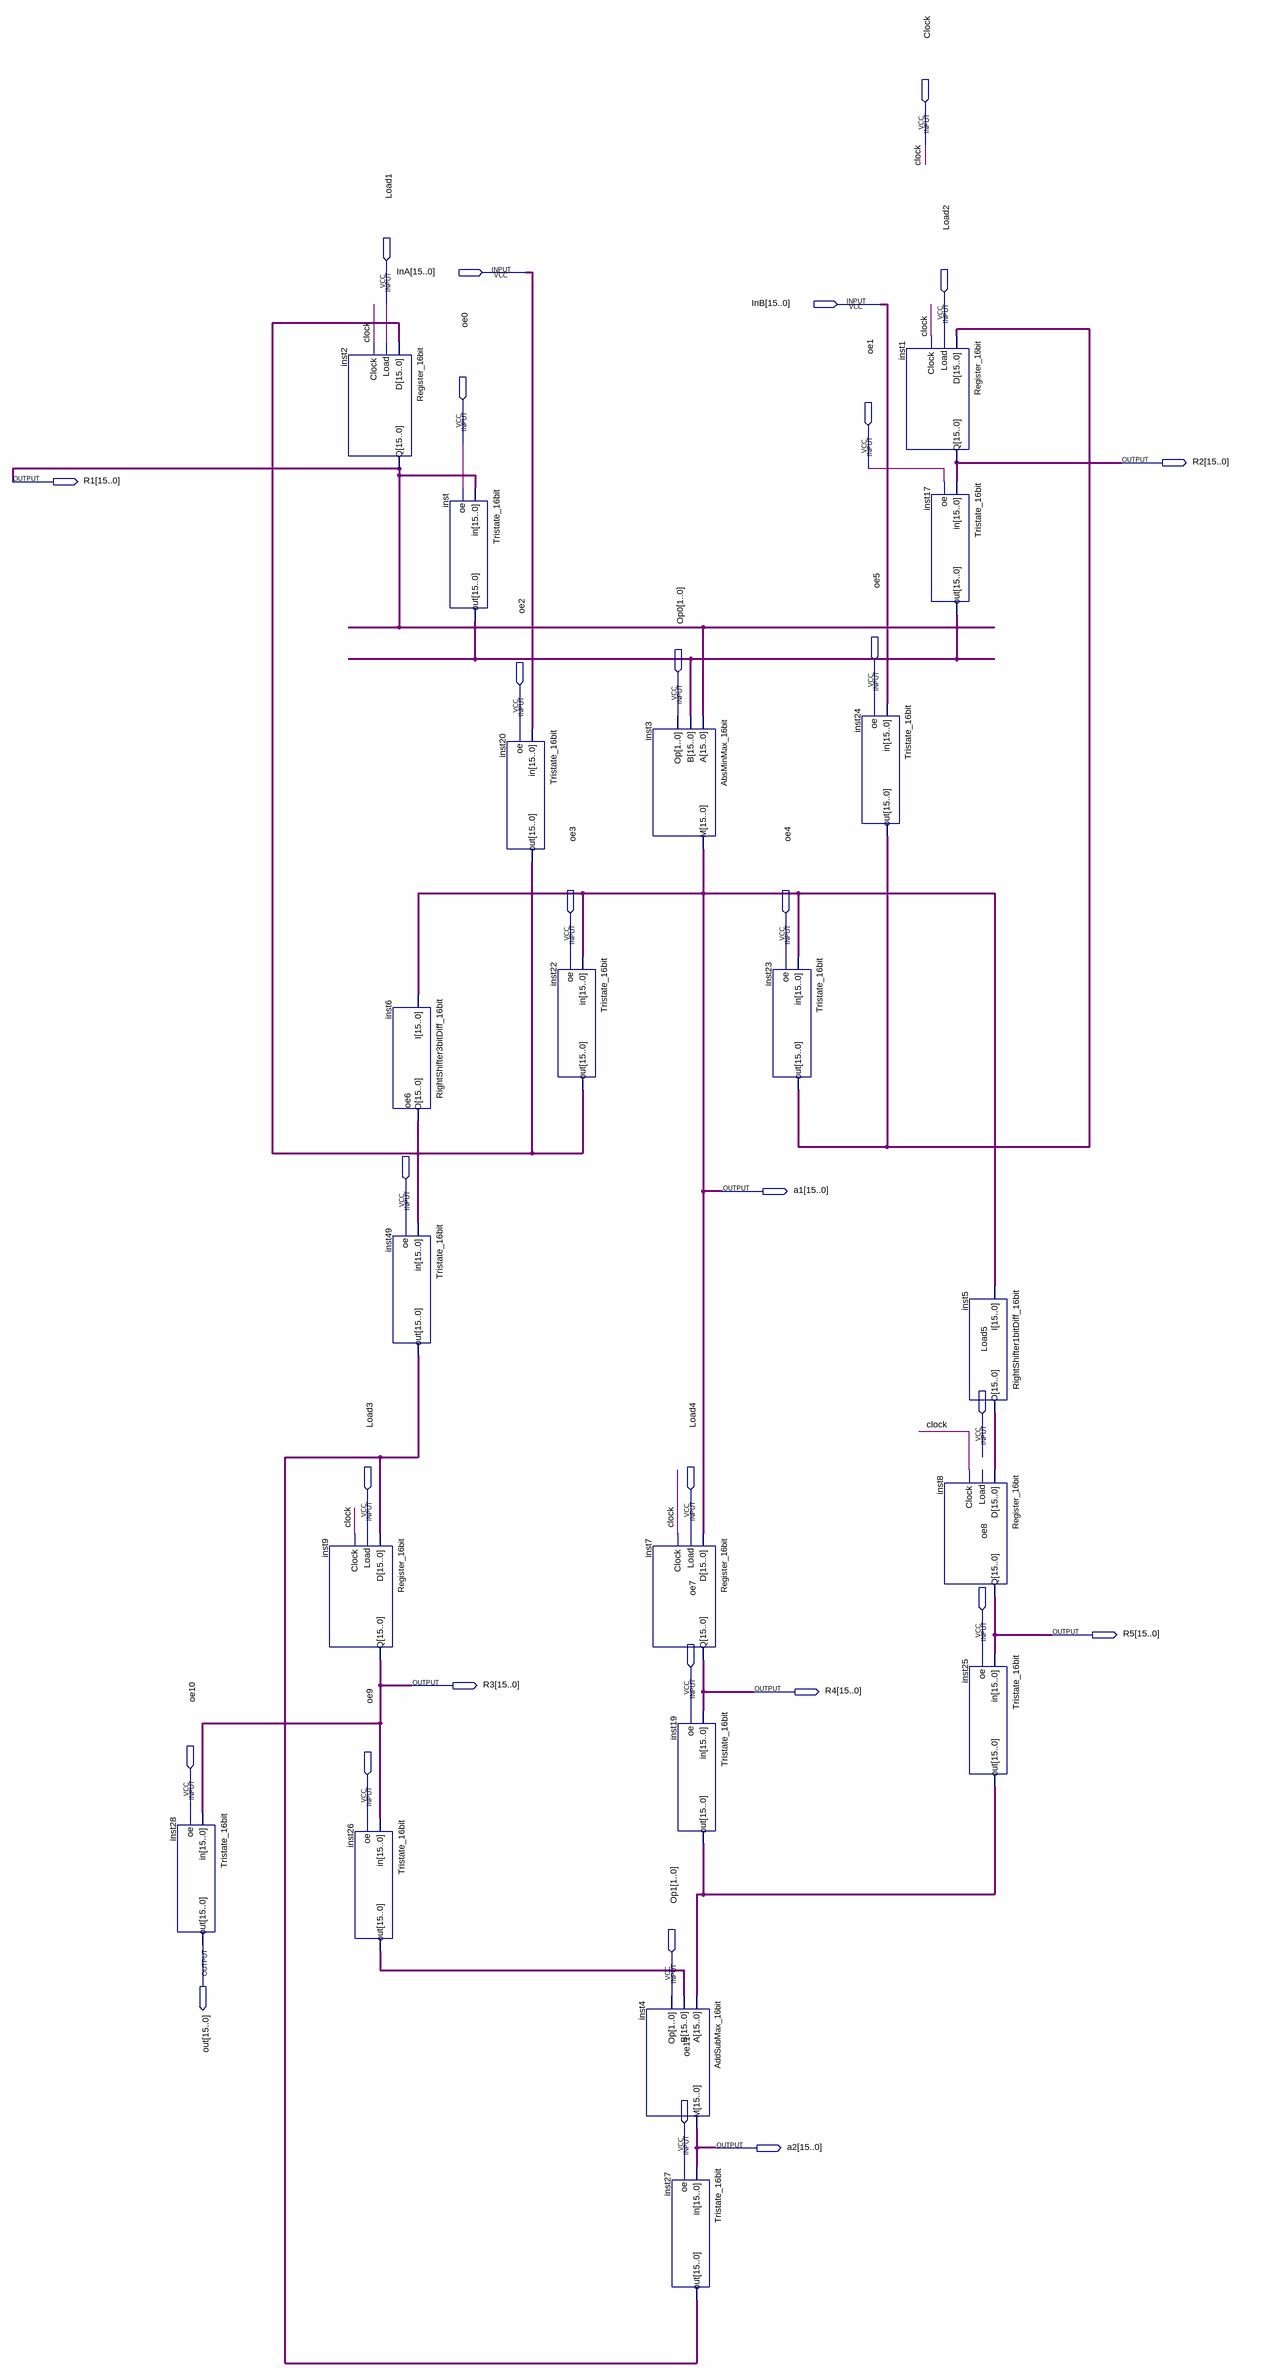
[diagram p0: schematic sheet]
// Quartus schematic Datapath_block.bdf as structural Verilog: 21 symbols, 30 pins
module Datapath_block (
  input  Clock,
  input  [15:0] InA,
  input  Load1,
  input  [15:0] InB,
  input  Load2,
  input  oe0,
  input  oe1,
  input  oe5,
  input  [1:0] Op0,
  input  oe2,
  input  oe3,
  input  oe4,
  input  oe6,
  input  Load5,
  input  Load3,
  input  Load4,
  input  oe8,
  input  oe7,
  input  oe10,
  input  oe9,
  input  [1:0] Op1,
  input  oe11,
  output [15:0] R2,
  output [15:0] R1,
  output [15:0] a1,
  output [15:0] R5,
  output [15:0] R3,
  output [15:0] R4,
  output [15:0] out,
  output [15:0] a2
);

  wire [15:0] inst5_o, inst6_o, inst19_out, inst20_out, inst23_out, inst26_out, inst49_out, inst_out;

  Tristate_16bit inst28 (.in(R3), .oe(oe10), .out(out));
  Register_16bit inst2 (.D(inst20_out), .Load(Load1), .Clock(Clock), .Q(R1));
  Register_16bit inst9 (.D(inst49_out), .Load(Load3), .Clock(Clock), .Q(R3));
  Tristate_16bit inst26 (.in(R3), .oe(oe9), .out(inst26_out));
  RightShifter3bitDiff_16bit inst6 (.I(a1), .O(inst6_o));
  Tristate_16bit inst49 (.in(inst6_o), .oe(oe6), .out(inst49_out));
  Tristate_16bit inst (.in(R1), .oe(oe0), .out(inst_out));
  Tristate_16bit inst20 (.in(InA), .oe(oe2), .out(inst20_out));
  Tristate_16bit inst22 (.in(a1), .oe(oe3), .out(inst20_out));
  AbsMinMax_16bit inst3 (.A(R1), .B(inst_out), .Op(Op0), .M(a1));
  Register_16bit inst7 (.D(a1), .Load(Load4), .Clock(Clock), .Q(R4));
  Tristate_16bit inst19 (.in(R4), .oe(oe7), .out(inst19_out));
  AddSubMax_16bit inst4 (.A(inst19_out), .B(inst26_out), .Op(Op1), .M(a2));
  Tristate_16bit inst27 (.in(a2), .oe(oe11), .out(inst49_out));
  Tristate_16bit inst23 (.in(a1), .oe(oe4), .out(inst23_out));
  Tristate_16bit inst24 (.in(InB), .oe(oe5), .out(inst23_out));
  Register_16bit inst1 (.D(inst23_out), .Load(Load2), .Clock(Clock), .Q(R2));
  Tristate_16bit inst17 (.in(R2), .oe(oe1), .out(inst_out));
  RightShifter1bitDiff_16bit inst5 (.I(a1), .O(inst5_o));
  Register_16bit inst8 (.D(inst5_o), .Clock(Clock), .Q(R5));  // open: Load
  Tristate_16bit inst25 (.in(R5), .oe(oe8), .out(inst19_out));
endmodule
